# Altium project Back.PrjPcb
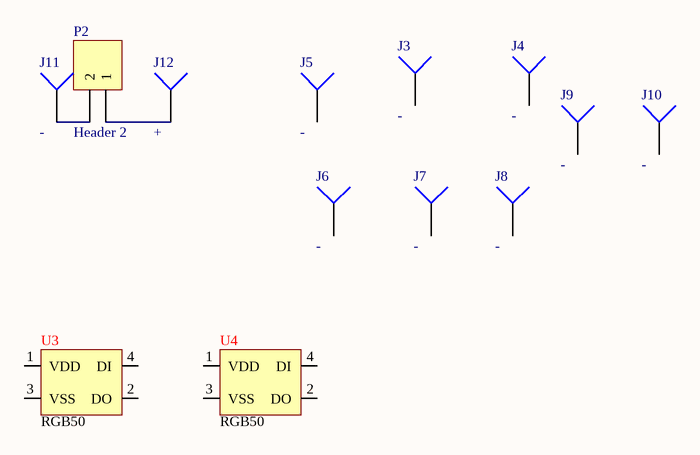
[diagram p0: Back.SchDoc]
1 sheet, 13 parts. Net scope: global (net labels, ports and power ports of the same name join across sheets).
Board files: Back_M.PcbDoc, Back.PcbDoc

## Sheet Back.SchDoc
size A4

### Parts
J3  -  [Padl]
J4  -  [Padl]
J5  -  [Padl]
J6  -  [Padl]
J7  -  [Padl]
J8  -  [Padl]
J9  -  [Padl]
J10  -  [Padl]
J11  -  [PIN]
J12  +  [PIN]
P2  Header 2  [HEAD2.0]
U3  RGB50  [EYE-BLOCK]
U4  RGB50  [EYE-BLOCK]

### Nets
NetJ11_1: J11.1 P2.2
NetJ12_1: J12.1 P2.1

Not connected (* = marked no-connect by the designer): J3 1; J4 1; J5 1; J6 1; J7 1; J8 1; J9 1; J10 1; U3 1(VDD) 2(DO) 3(VSS) 4(DI); U4 1(VDD) 2(DO) 3(VSS) 4(DI)

### Library data of the parts
J3-J12 = Socket: LatestRevisionDate: 17-Jul-2002; LatestRevisionNote: Re-released for DXP Platform.; Publisher: Altium Limited
P2 = Header 2: 电池供电跳线帽; LatestRevisionDate: 17-Jul-2002; LatestRevisionNote: Re-released for DXP Platform.; Publisher: Altium Limited